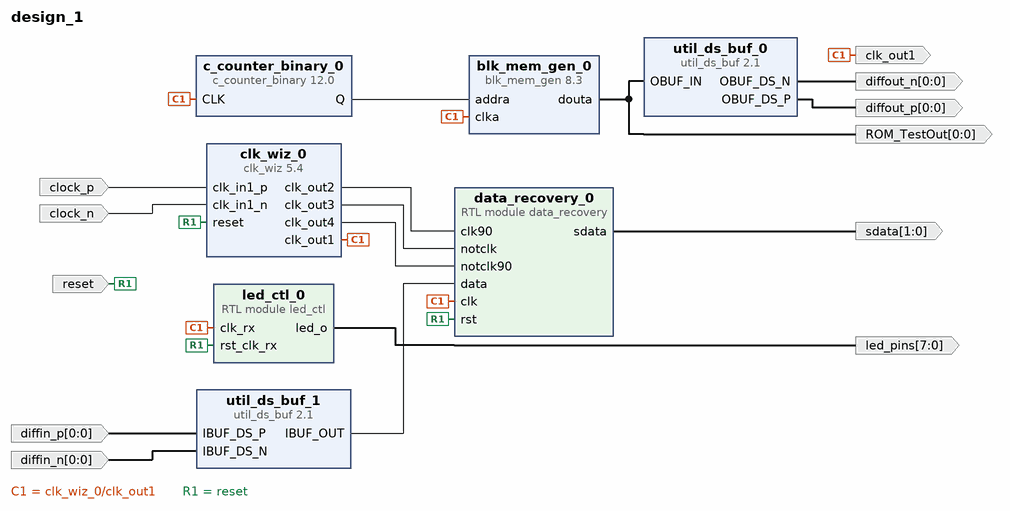
[diagram p0: block diagram of the top level]
# Vivado block design design_1, xc7vx485tffg1761-2, Vivado 2017.2
create_bd_design design_1

create_bd_port -dir O -from 7 -to 0 led_pins
create_bd_port -dir I -from 0 -to 0 -type clk diffin_p
create_bd_port -dir I -from 0 -to 0 -type clk diffin_n
create_bd_port -dir O clk_out1
create_bd_port -dir O -from 0 -to 0 -type clk diffout_p
create_bd_port -dir O -from 0 -to 0 -type clk diffout_n
create_bd_port -dir I clock_p
create_bd_port -dir I clock_n
create_bd_port -dir I -type rst reset
set_property -dict {CONFIG.POLARITY ACTIVE_HIGH} [get_bd_ports reset]
create_bd_port -dir O -from 1 -to 0 sdata
create_bd_port -dir O -from 0 -to 0 ROM_TestOut

create_bd_cell -type ip -vlnv xilinx.com:ip:clk_wiz:5.4 clk_wiz_0
set_property -dict [list \
  CONFIG.CLKOUT2_USED true \
  CONFIG.CLKOUT3_USED true \
  CONFIG.CLKOUT4_USED true \
  CONFIG.NUM_OUT_CLKS 4 \
  CONFIG.CLKOUT1_REQUESTED_OUT_FREQ 200 \
  CONFIG.CLKOUT2_REQUESTED_OUT_FREQ 200 \
  CONFIG.CLKOUT2_REQUESTED_PHASE 90.000 \
  CONFIG.CLKOUT3_REQUESTED_OUT_FREQ 200 \
  CONFIG.CLKOUT3_REQUESTED_PHASE 180.000 \
  CONFIG.CLKOUT4_REQUESTED_OUT_FREQ 200 \
  CONFIG.CLKOUT4_REQUESTED_PHASE 270.000 \
  CONFIG.PRIM_SOURCE Differential_clock_capable_pin \
  CONFIG.USE_LOCKED false \
  CONFIG.USE_RESET true \
  CONFIG.MMCM_DIVCLK_DIVIDE 1 \
  CONFIG.MMCM_CLKFBOUT_MULT_F 5.000 \
  CONFIG.MMCM_CLKOUT0_DIVIDE_F 5.000 \
  CONFIG.MMCM_CLKOUT1_DIVIDE 5 \
  CONFIG.MMCM_CLKOUT1_PHASE 90.000 \
  CONFIG.MMCM_CLKOUT2_DIVIDE 5 \
  CONFIG.MMCM_CLKOUT2_PHASE 180.000 \
  CONFIG.MMCM_CLKOUT3_DIVIDE 5 \
  CONFIG.MMCM_CLKOUT3_PHASE 270.000 \
  CONFIG.USE_BOARD_FLOW true \
  CONFIG.CLK_IN1_BOARD_INTERFACE sys_diff_clock \
  CONFIG.RESET_BOARD_INTERFACE reset \
  CONFIG.CLKOUT1_JITTER 98.146 \
  CONFIG.CLKOUT1_PHASE_ERROR 89.971 \
  CONFIG.CLKOUT2_JITTER 98.146 \
  CONFIG.CLKOUT2_PHASE_ERROR 89.971 \
  CONFIG.CLKOUT3_JITTER 98.146 \
  CONFIG.CLKOUT3_PHASE_ERROR 89.971 \
  CONFIG.CLKOUT4_JITTER 98.146 \
  CONFIG.CLKOUT4_PHASE_ERROR 89.971 \
] [get_bd_cells clk_wiz_0]
create_bd_cell -type module -reference led_ctl led_ctl_0
create_bd_cell -type ip -vlnv xilinx.com:ip:blk_mem_gen:8.3 blk_mem_gen_0
set_property -dict [list \
  CONFIG.Memory_Type Single_Port_ROM \
  CONFIG.Enable_32bit_Address false \
  CONFIG.Write_Width_A 1 \
  CONFIG.Write_Depth_A 14400 \
  CONFIG.Enable_A Always_Enabled \
  CONFIG.Register_PortA_Output_of_Memory_Primitives true \
  CONFIG.Load_Init_File true \
  CONFIG.Coe_File ../../../../../../../../Users/s883g970/Desktop/bert_110317/5b_bitstream.coe \
  CONFIG.Use_RSTA_Pin false \
  CONFIG.Port_A_Write_Rate 0 \
  CONFIG.use_bram_block Stand_Alone \
] [get_bd_cells blk_mem_gen_0]
create_bd_cell -type ip -vlnv xilinx.com:ip:c_counter_binary:12.0 c_counter_binary_0
set_property -dict {CONFIG.Output_Width 14 CONFIG.CE false} [get_bd_cells c_counter_binary_0]
create_bd_cell -type ip -vlnv xilinx.com:ip:util_ds_buf:2.1 util_ds_buf_0
set_property -dict {CONFIG.C_BUF_TYPE OBUFDS} [get_bd_cells util_ds_buf_0]
create_bd_cell -type ip -vlnv xilinx.com:ip:util_ds_buf:2.1 util_ds_buf_1
set_property -dict {CONFIG.USE_BOARD_FLOW true CONFIG.DIFF_CLK_IN_BOARD_INTERFACE Custom} [get_bd_cells util_ds_buf_1]
create_bd_cell -type module -reference data_recovery data_recovery_0

# ---- connections ----

connect_bd_net [get_bd_pins led_ctl_0/led_o] [get_bd_ports led_pins]
connect_bd_net [get_bd_pins c_counter_binary_0/Q] [get_bd_pins blk_mem_gen_0/addra]
connect_bd_net [get_bd_ports diffin_p] [get_bd_pins util_ds_buf_1/IBUF_DS_P]
connect_bd_net [get_bd_ports diffin_n] [get_bd_pins util_ds_buf_1/IBUF_DS_N]
connect_bd_net [get_bd_pins blk_mem_gen_0/douta] [get_bd_pins util_ds_buf_0/OBUF_IN] [get_bd_ports ROM_TestOut]
connect_bd_net [get_bd_pins clk_wiz_0/clk_out1] \
  [get_bd_ports clk_out1] [get_bd_pins blk_mem_gen_0/clka] [get_bd_pins c_counter_binary_0/CLK] \
  [get_bd_pins led_ctl_0/clk_rx] [get_bd_pins data_recovery_0/clk]
connect_bd_net [get_bd_pins util_ds_buf_0/OBUF_DS_P] [get_bd_ports diffout_p]
connect_bd_net [get_bd_pins util_ds_buf_0/OBUF_DS_N] [get_bd_ports diffout_n]
connect_bd_net [get_bd_ports clock_p] [get_bd_pins clk_wiz_0/clk_in1_p]
connect_bd_net [get_bd_ports clock_n] [get_bd_pins clk_wiz_0/clk_in1_n]
connect_bd_net [get_bd_ports reset] [get_bd_pins clk_wiz_0/reset] [get_bd_pins data_recovery_0/rst] [get_bd_pins led_ctl_0/rst_clk_rx]
connect_bd_net [get_bd_pins util_ds_buf_1/IBUF_OUT] [get_bd_pins data_recovery_0/data]
connect_bd_net [get_bd_pins clk_wiz_0/clk_out2] [get_bd_pins data_recovery_0/clk90]
connect_bd_net [get_bd_pins clk_wiz_0/clk_out3] [get_bd_pins data_recovery_0/notclk]
connect_bd_net [get_bd_pins clk_wiz_0/clk_out4] [get_bd_pins data_recovery_0/notclk90]
connect_bd_net [get_bd_pins data_recovery_0/sdata] [get_bd_ports sdata]

validate_bd_design
save_bd_design
